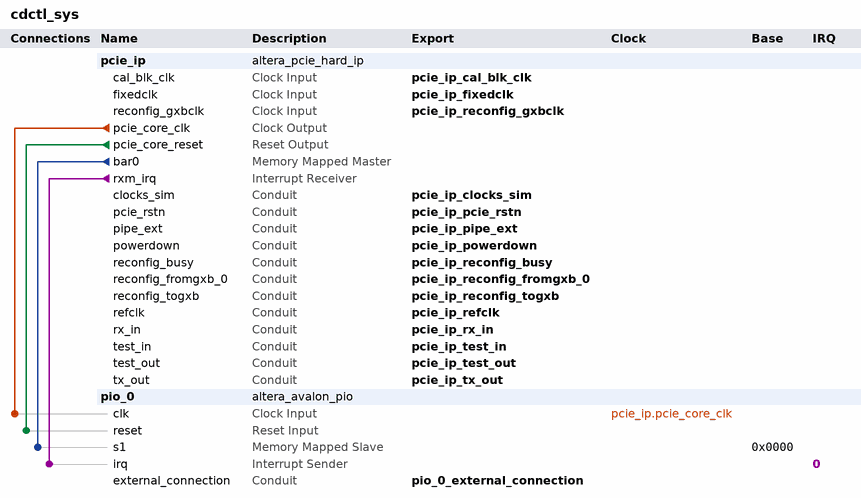
[diagram p0: system contents]
# Platform Designer (Qsys) system cdctl_sys, Cyclone IV GX EP4CGX15BF14C8
# Parameters at their usual value, and those the tool derives, are not listed.
package require -exact qsys 18.0
create_system cdctl_sys
set_project_property DEVICE_FAMILY {Cyclone IV GX}
set_project_property DEVICE EP4CGX15BF14C8

add_instance pcie_ip altera_pcie_hard_ip 18.0
set_instance_parameter_value pcie_ip {BAR Type} {32 bit Non-Prefetchable,Not used,Not used,Not used,Not used,Not used}
set_instance_parameter_value pcie_ip CB_A2P_ADDR_MAP_PASS_THRU_BITS 20
set_instance_parameter_value pcie_ip CB_PCIE_MODE 1
set_instance_parameter_value pcie_ip CB_PCIE_RX_LITE 1
set_instance_parameter_value pcie_ip CG_ENABLE_A2P_INTERRUPT 0
set_instance_parameter_value pcie_ip CG_IMPL_CRA_AV_SLAVE_PORT 0
set_instance_parameter_value pcie_ip CG_NO_CPL_REORDERING 0
set_instance_parameter_value pcie_ip {PCIe Address 31:0} 0x00000000,0x00000000,0x00000000,0x00000000,0x00000000,0x00000000,0x00000000,0x00000000,0x00000000,0x00000000,0x00000000,0x00000000,0x00000000,0x00000000,0x00000000,0x00000000
set_instance_parameter_value pcie_ip {PCIe Address 63:32} 0x00000000,0x00000000,0x00000000,0x00000000,0x00000000,0x00000000,0x00000000,0x00000000,0x00000000,0x00000000,0x00000000,0x00000000,0x00000000,0x00000000,0x00000000,0x00000000
set_instance_parameter_value pcie_ip class_code 0
set_instance_parameter_value pcie_ip device_id 4
set_instance_parameter_value pcie_ip my_advanced_errors false
set_instance_parameter_value pcie_ip my_enable_ecrc_check false
set_instance_parameter_value pcie_ip my_enable_ecrc_gen false
set_instance_parameter_value pcie_ip p_pcie_app_clk 1
set_instance_parameter_value pcie_ip p_pcie_test_out_width 64bits
set_instance_parameter_value pcie_ip p_user_msi_enable 0
set_instance_parameter_value pcie_ip subsystem_device_id 4
set_instance_parameter_value pcie_ip subsystem_vendor_id 4466
set_instance_parameter_value pcie_ip vendor_id 4466

add_instance pio_0 altera_avalon_pio 18.0
set_instance_parameter_value pio_0 bitClearingEdgeCapReg true
set_instance_parameter_value pio_0 bitModifyingOutReg true
set_instance_parameter_value pio_0 captureEdge true
set_instance_parameter_value pio_0 direction Bidir
set_instance_parameter_value pio_0 edgeType FALLING
set_instance_parameter_value pio_0 generateIRQ true
set_instance_parameter_value pio_0 irqType EDGE
set_instance_parameter_value pio_0 width 16

# connections
add_connection pcie_ip.pcie_core_clk pio_0.clk clock
add_connection pcie_ip.pcie_core_reset pio_0.reset reset
add_connection pcie_ip.bar0 pio_0.s1 avalon
set_connection_parameter_value pcie_ip.bar0/pio_0.s1 baseAddress 0x0000
add_connection pcie_ip.rxm_irq pio_0.irq interrupt
set_connection_parameter_value pcie_ip.rxm_irq/pio_0.irq irqNumber 0

# exported interfaces
add_interface pcie_ip_cal_blk_clk clock sink
set_interface_property pcie_ip_cal_blk_clk EXPORT_OF pcie_ip.cal_blk_clk
add_interface pcie_ip_clocks_sim conduit end
set_interface_property pcie_ip_clocks_sim EXPORT_OF pcie_ip.clocks_sim
add_interface pcie_ip_fixedclk clock sink
set_interface_property pcie_ip_fixedclk EXPORT_OF pcie_ip.fixedclk
add_interface pcie_ip_pcie_rstn conduit end
set_interface_property pcie_ip_pcie_rstn EXPORT_OF pcie_ip.pcie_rstn
add_interface pcie_ip_pipe_ext conduit end
set_interface_property pcie_ip_pipe_ext EXPORT_OF pcie_ip.pipe_ext
add_interface pcie_ip_powerdown conduit end
set_interface_property pcie_ip_powerdown EXPORT_OF pcie_ip.powerdown
add_interface pcie_ip_reconfig_busy conduit end
set_interface_property pcie_ip_reconfig_busy EXPORT_OF pcie_ip.reconfig_busy
add_interface pcie_ip_reconfig_fromgxb_0 conduit end
set_interface_property pcie_ip_reconfig_fromgxb_0 EXPORT_OF pcie_ip.reconfig_fromgxb_0
add_interface pcie_ip_reconfig_gxbclk clock sink
set_interface_property pcie_ip_reconfig_gxbclk EXPORT_OF pcie_ip.reconfig_gxbclk
add_interface pcie_ip_reconfig_togxb conduit end
set_interface_property pcie_ip_reconfig_togxb EXPORT_OF pcie_ip.reconfig_togxb
add_interface pcie_ip_refclk conduit end
set_interface_property pcie_ip_refclk EXPORT_OF pcie_ip.refclk
add_interface pcie_ip_rx_in conduit end
set_interface_property pcie_ip_rx_in EXPORT_OF pcie_ip.rx_in
add_interface pcie_ip_test_in conduit end
set_interface_property pcie_ip_test_in EXPORT_OF pcie_ip.test_in
add_interface pcie_ip_test_out conduit end
set_interface_property pcie_ip_test_out EXPORT_OF pcie_ip.test_out
add_interface pcie_ip_tx_out conduit end
set_interface_property pcie_ip_tx_out EXPORT_OF pcie_ip.tx_out
add_interface pio_0_external_connection conduit end
set_interface_property pio_0_external_connection EXPORT_OF pio_0.external_connection

set_interconnect_requirement {$system} qsys_mm.clockCrossingAdapter AUTO
set_interconnect_requirement {$system} qsys_mm.enableEccProtection FALSE
set_interconnect_requirement {$system} qsys_mm.insertDefaultSlave FALSE
set_interconnect_requirement {$system} qsys_mm.maxAdditionalLatency 2

save_system cdctl_sys.qsys
